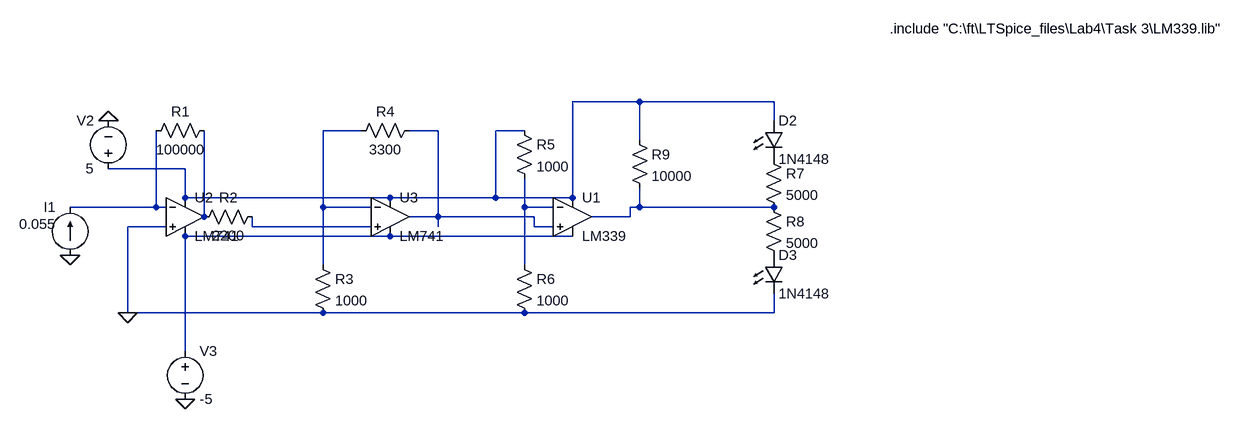
[diagram p0: schematic Lab5_1.asc]
Lab5_1.asc, the LTspice schematic file:
Version 4.1
SHEET 1 4384 1204
WIRE 160 32 48 32
WIRE 592 32 160 32
WIRE 592 64 592 32
WIRE -304 80 -368 80
WIRE -176 80 -224 80
WIRE -32 80 -80 80
WIRE 160 96 160 32
WIRE -656 144 -784 144
WIRE -656 192 -656 144
WIRE -256 192 -656 192
WIRE -80 192 -80 80
WIRE -80 192 -256 192
WIRE 48 192 48 32
WIRE 48 192 -80 192
WIRE -704 208 -704 80
WIRE -704 208 -848 208
WIRE -688 208 -704 208
WIRE -368 208 -368 80
WIRE -288 208 -368 208
WIRE -32 208 -32 160
WIRE 16 208 -32 208
WIRE 160 208 160 176
WIRE 160 208 144 208
WIRE 592 208 160 208
WIRE -624 224 -624 80
WIRE -176 224 -176 80
WIRE -176 224 -224 224
WIRE -16 224 -176 224
WIRE 144 224 144 208
WIRE 144 224 80 224
WIRE -688 240 -752 240
WIRE -544 240 -544 224
WIRE -288 240 -544 240
WIRE -176 240 -176 224
WIRE -16 240 -16 224
WIRE 16 240 -16 240
WIRE -256 256 -656 256
WIRE 48 256 -256 256
WIRE -368 304 -368 208
WIRE -32 304 -32 208
WIRE -752 384 -752 240
WIRE -368 384 -752 384
WIRE -32 384 -368 384
WIRE 592 384 592 352
WIRE 592 384 -32 384
WIRE -656 448 -656 256
FLAG -784 64 0
FLAG -656 528 0
FLAG -752 384 0
FLAG -848 288 0
SYMBOL LM339 48 224 R0
SYMATTR InstName U1
SYMATTR SpiceModel ""
SYMBOL LM741 -656 160 R0
SYMATTR InstName U2
SYMBOL LM741 -256 160 R0
SYMATTR InstName U3
SYMBOL res -608 64 R90
WINDOW 0 0 56 VBottom 2
WINDOW 3 32 56 VTop 2
SYMATTR InstName R1
SYMATTR Value 100000
SYMBOL res -528 208 R90
WINDOW 0 0 56 VBottom 2
WINDOW 3 32 56 VTop 2
SYMATTR InstName R2
SYMATTR Value 2200
SYMBOL res -384 288 R0
SYMATTR InstName R3
SYMATTR Value 1000
SYMBOL res -208 64 R90
WINDOW 0 0 56 VBottom 2
WINDOW 3 32 56 VTop 2
SYMATTR InstName R4
SYMATTR Value 3300
SYMBOL res -48 64 R0
SYMATTR InstName R5
SYMATTR Value 1000
SYMBOL res -48 288 R0
SYMATTR InstName R6
SYMATTR Value 1000
SYMBOL LED 576 64 R0
SYMATTR InstName D2
SYMATTR Value 1N4148
SYMBOL res 576 112 R0
SYMATTR InstName R7
SYMATTR Value 5000
SYMBOL res 576 192 R0
SYMATTR InstName R8
SYMATTR Value 5000
SYMBOL LED 576 288 R0
SYMATTR InstName D3
SYMATTR Value 1N4148
SYMBOL voltage -784 160 R180
WINDOW 0 24 96 Left 2
WINDOW 3 24 16 Left 2
WINDOW 123 0 0 Left 0
WINDOW 39 0 0 Left 0
SYMATTR InstName V2
SYMATTR Value 5
SYMBOL voltage -656 432 R0
WINDOW 123 0 0 Left 0
WINDOW 39 0 0 Left 0
SYMATTR InstName V3
SYMATTR Value -5
SYMBOL res 144 80 R0
SYMATTR InstName R9
SYMATTR Value 10000
SYMBOL current -848 288 R180
WINDOW 0 24 80 Left 2
WINDOW 3 24 52 Left 2
WINDOW 123 0 0 Left 0
WINDOW 39 0 0 Left 0
SYMATTR InstName I1
SYMATTR Value 0.055
TEXT 3752 -1120 Left 2 !.include "C:\\ft\\LTSpice_files\\Lab4\\Task 3\\LM339.lib"

The netlist it stands for:
* Lab5_1.asc
* U1: LM339 (symbol LM339 not available, pins judged from their places): In+=N003 In-=N005 V+=N001 V-=N009 OUT=N006
X§U2 0 N004 N001 N009 N007 LM741  ; pins In+ In- V+ V- OUT
X§U3 N008 N002 N001 N009 N003 LM741  ; pins In+ In- V+ V- OUT
R1 N007 N004 100000
R2 N008 N007 2200
R3 N002 0 1000
R4 N003 N002 3300
R5 N001 N005 1000
R6 N005 0 1000
D2 N001 P001 1N4148
R7 P001 N006 5000
R8 N006 P002 5000
D3 P002 0 1N4148
V2 N001 0 5
V3 N009 0 -5
R9 N001 N006 10000
I1 0 N004 0.055
.model D D
.lib standard.dio
.include "C:\ft\LTSpice_files\Lab4\Task 3\LM339.lib"
.lib LM741.lib
.backanno
.end